# Altium project Gas_Sampler.PrjPcb (part 3 of 3)

## Sheet Gas_Sampler-9V_Boost.SchDoc: 9V Boost
size Tabloid; Organization: Sensible Robotics LLC; Address1: 120 E Church Ave Suite B; Address2: Ridgecrest CA, 93555; Revision: 0; SheetNumber: 6; SheetTotal: 12; ApprovedBy: Approved Name; Engineer: Mike Licitra; PageSetup: Record=PageOptions|CenterHorizontal=True|CenterVertical=True|PrintScale=0.98|XCorrection=1.00|YCorrection=1.00|PrintKind=0|BorderSize=5000000|LeftOffset=0|BottomOffset=0|Orientation=2|PaperLength=1000|PaperWidth=1000|Scale=100|PaperSource=15|PrintQuality=600|MediaType=1|DitherType=10|PaperKind=Tabloid|PrintScaleMode=1
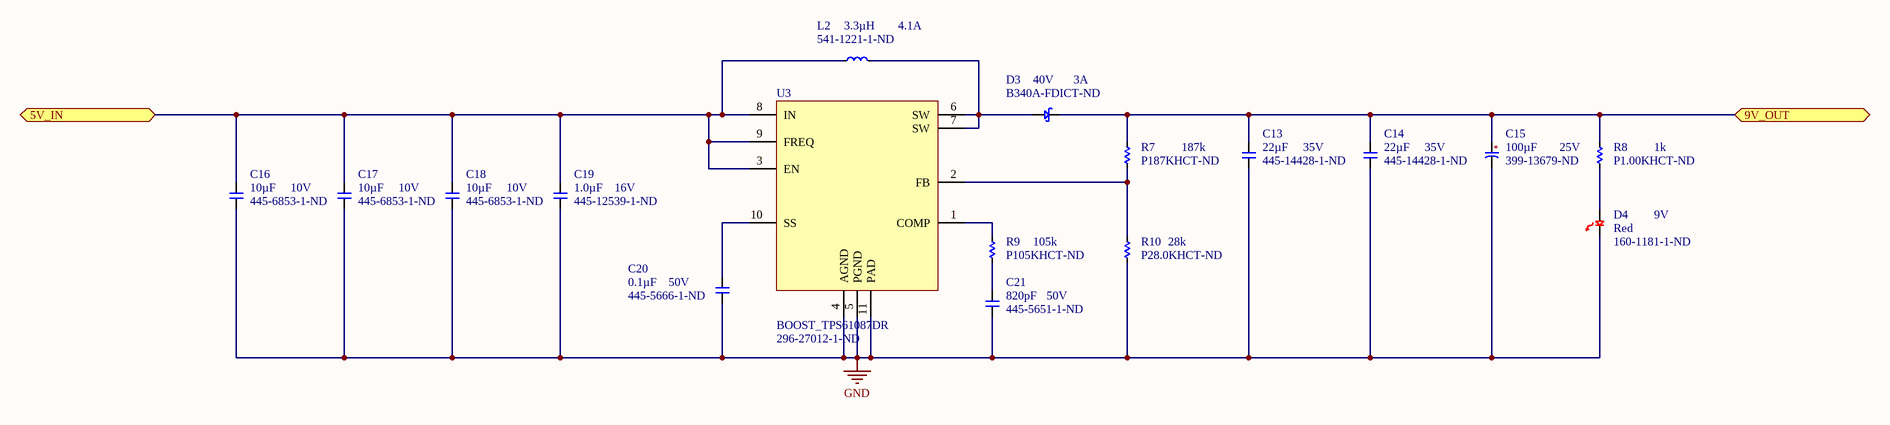
[diagram p11: Gas_Sampler-9V_Boost.SchDoc]

### Parts
C13  value 22µF  Supplier Part Number 1: 445-14428-1-ND  Voltage - Rated: 35V  [C0805]  (hidden comment: CAP_CER_0805_22UF_35V_20%_X5R)
C14  value 22µF  Supplier Part Number 1: 445-14428-1-ND  Voltage - Rated: 35V  [C0805]  (hidden comment: CAP_CER_0805_22UF_35V_20%_X5R)
C15  value 100µF  Supplier Part Number 1: 399-13679-ND  Voltage: 25V  [CAP_RADIAL_8MM_DIA_9MM_LEN_3.5MM_LEADSPACE]  (hidden comment: CAP_POLYMER_100UF_25V_20%_8X9MM_TH)
C16  value 10µF  Voltage - Rated: 10V  Supplier Part Number 1: 445-6853-1-ND  [C0603]  (hidden comment: CAP_CER_0603_10UF_10V_20%_X5R)
C17  value 10µF  Voltage - Rated: 10V  Supplier Part Number 1: 445-6853-1-ND  [C0603]  (hidden comment: CAP_CER_0603_10UF_10V_20%_X5R)
C18  value 10µF  Voltage - Rated: 10V  Supplier Part Number 1: 445-6853-1-ND  [C0603]  (hidden comment: CAP_CER_0603_10UF_10V_20%_X5R)
C19  value 1.0µF  Supplier Part Number 1: 445-12539-1-ND  Voltage - Rated: 16V  [C0603]  (hidden comment: CAP_CER_0603_1UF_16V_10%_X7R)
C20  value 0.1µF  Voltage - Rated: 50V  Supplier Part Number 1: 445-5666-1-ND  [C0603]  (hidden comment: CAP_CER_0603_0.1UF_50V_10%_X7R)
C21  value 820pF  Voltage - Rated: 50V  Supplier Part Number 1: 445-5651-1-ND  [C0603]  (hidden comment: CAP_CER_0603_820PF_50V_5%_C0G/NP0)
D3  Supplier Part Number 1: B340A-FDICT-ND  Voltage - DC Reverse (Vr) (Max): 40V  Current - Average Rectified (Io): 3A  [SMA]  (hidden comment: SCHOTTKY_40V_3A_B340A-13-F)
D4  9V  Supplier Part Number 1: 160-1181-1-ND  Color: Red  [LED_0603_RED]
L2  value 3.3µH  Current Rating: 4.1A  Supplier Part Number 1: 541-1221-1-ND  [INDUCTOR_IHLP2020_2MM_HEIGHT]  (hidden comment: IND_3.3UH_4.1A_IHLP2020BZER3R3M11)
R7  value 187k  Supplier Part Number 1: P187KHCT-ND  [R0603]  (hidden comment: RES_0603_187K_OHMS_1/10W_1%)
R8  value 1k  Supplier Part Number 1: P1.00KHCT-ND  [R0603]  (hidden comment: RES_0603_1K_OHM_1/10W_1%)
R9  value 105k  Supplier Part Number 1: P105KHCT-ND  [R0603]  (hidden comment: RES_0603_105K_OHM_1/10W_1%)
R10  value 28k  Supplier Part Number 1: P28.0KHCT-ND  [R0603]  (hidden comment: RES_0603_28K_OHM_1/10W_1%)
U3  BOOST_TPS61087DR  Supplier Part Number 1: 296-27012-1-ND  [PVSON50P300X300X70-10N]

### Ports
5V_IN, 9V_OUT

### Nets
+5: C16.1 C17.1 C18.1 C19.1 L2.1 U3.3(EN) U3.8(IN) U3.9(FREQ) ; port 5V_IN
GND: C13.2 C14.2 C15.2 C16.2 C17.2 C18.2 C19.2 C20.2 C21.2 D4.2(CATHODE) R10.1 U3.4(AGND) U3.5(PGND) U3.11(PAD)
NetC13_1: C13.1 C14.1 C15.1 D3.2 R7.2 R8.2 ; port 9V_OUT
NetC20_1: C20.1 U3.10(SS)
NetC21_1: C21.1 R9.1
NetD3_1: D3.1 L2.2 U3.6(SW) U3.7(SW)
NetD4_1: D4.1(ANODE) R8.1
NetR7_1: R7.1 R10.2 U3.2(FB)
NetR9_2: R9.2 U3.1(COMP)

### Notes on the sheet
- CONFIDENTIAL DOCUMENT
- DUPLICATION PROHIBITED
- ENGINEER
- PCB FAB #
- SCH #
- REV
- Sensible
- Robotics
- THIS DOCUMENT CONTAINS INFORMATION AND OR DATA, WHICH IS PROPRIETARY AND CONFIDENTIAL TO SENSIBLE ROBOTICS LLC.  THIS INFORMATION AND OR DATA, IS TO BE USED ONLY FOR THE BENEFIT OF THE SUPPLIER, AND IS NOT TO BE USED FOR THE BENEFIT OF OTHER PARTIES WITHOUT WRITTEN CONSENT.
- DATE
- PCB ASSY #
- SIZE
- Tabloid
- SHEET
- OF
- FILE
- (in symbol CAP_POLYMER_100UF_25V_20%_8X9MM_TH) +

### Library data of the parts
C13 C14 = CAP_CER_0805_22UF_35V_20%_X5R: CAP CER 22UF 35V 20% X5R 0805; Manufacturer: TDK Corporation; Manufacturer Part Number: C2012X5R1V226M125AC; Part Number: 150-00071-00; Supplier 1: Digi-Key; RoHS: RoHS Compliant; Category: Capacitors; Stock 1: 6377; Pricing 1: 1=1.18, 10=0.987, 100=0.63, 250=0.525, 500=0.4725, 1000=0.4305 (USD); Packaging: Cut Tape (CT); Tolerance: ±20%; Temperature Coefficient: X5R; Mounting Type: Surface Mount, MLCC; Operating Temperature: -55°C ~ 85°C; Applications: General Purpose; Package / Case: 0805 (2012 Metric); Size / Dimension: 0.079" L x 0.049" W (2.00mm x 1.25mm); Thickness (Max): 0.057" (1.45mm); ComponentLink1URL: http://product.tdk.com/capacitor/mlcc/en/documents/mlcc_commercial_general_en.pdf; ComponentLink1Description: http://product.tdk.com/capacitor/mlcc/en/documents/mlcc_commercial_general_en.pdf
C15 = CAP_POLYMER_100UF_25V_20%_8X9MM_TH: CAP ALUM POLY 100UF 20% 25V T/H; Manufacturer: KEMET; Manufacturer Part Number: A750KK107M1EAAE040; ComponentLink1Description: Datasheet; ComponentLink1URL: https://api.kemet.com/component-edge/download/datasheet/A750KK107M1EAAE040.pdf; Supplier 1: Digikey; Tolerance: ±20%; Operating Temperature: -55°C ~ 105°C; Size / Dimension: 0.315" Dia (8.00mm); Height - Seated (Max): 0.354" (9.00mm); Mounting Type: Through Hole
C16-C18 = CAP_CER_0603_10UF_10V_20%_X5R: CAP CER 10UF 10V X5R 0603; Manufacturer: TDK Corporation; Manufacturer Part Number: C1608X5R1A106M080AC; Tolerance: ±20%; Supplier 1: Digi-Key; RoHS: RoHS Compliant; Packaging: Cut Tape (CT); Part Status: Active; Temperature Coefficient: X5R; Operating Temperature: -55°C ~ 85°C; Features: Low ESL; Applications: General Purpose; Mounting Type: Surface Mount, MLCC; Package / Case: 0603 (1608 Metric); Size / Dimension: 0.063" L x 0.032" W (1.60mm x 0.80mm); Thickness (Max): 0.035" (0.90mm); ComponentLink1URL: https://product.tdk.com/info/en/catalog/datasheets/mlcc_commercial_general_en.pdf; ComponentLink1Description: https://product.tdk.com/info/en/catalog/datasheets/mlcc_commercial_general_en.pdf
C19 = CAP_CER_0603_1UF_16V_10%_X7R: CAP CER 1UF 16V 10% X7R 0603; Manufacturer: TDK Corporation; Manufacturer Part Number: CGA3E1X7R1C105K080AC; Supplier 1: Digi-Key; RoHS: RoHS Compliant; Packaging: Cut Tape (CT); Tolerance: ±10%; Temperature Coefficient: X7R; Mounting Type: Surface Mount, MLCC; Operating Temperature: -55°C ~ 125°C; Applications: Automotive; Ratings: AEC-Q200; Package / Case: 0603 (1608 Metric); Size / Dimension: 0.063" L x 0.031" W (1.60mm x 0.80mm); Thickness (Max): 0.035" (0.90mm); ComponentLink1URL: http://product.tdk.com/capacitor/mlcc/en/documents/mlcc_automotive_general_en.pdf; ComponentLink1Description: http://product.tdk.com/capacitor/mlcc/en/documents/mlcc_automotive_general_en.pdf
C20 = CAP_CER_0603_0.1UF_50V_10%_X7R: CAP CER 0.1UF 50V 10% X7R 0603; Manufacturer: TDK Corporation; Manufacturer Part Number: CGA3E2X7R1H104K080AA; Supplier 1: Digi-Key; RoHS: RoHS Compliant; Packaging: Cut Tape (CT); Tolerance: ±10%; Temperature Coefficient: X7R; Mounting Type: Surface Mount, MLCC; Operating Temperature: -55°C ~ 125°C; Applications: Automotive; Ratings: AEC-Q200; Package / Case: 0603 (1608 Metric); Size / Dimension: 0.063" L x 0.031" W (1.60mm x 0.80mm); Thickness (Max): 0.035" (0.90mm); ComponentLink1URL: http://product.tdk.com/capacitor/mlcc/en/documents/mlcc_automotive_general_en.pdf; ComponentLink1Description: http://product.tdk.com/capacitor/mlcc/en/documents/mlcc_automotive_general_en.pdf
C21 = CAP_CER_0603_820PF_50V_5%_C0G/NP0: CAP CER 820PF 50V C0G 0603; Manufacturer: TDK Corporation; Manufacturer Part Number: CGA3E2C0G1H821J080AA; Tolerance: ±5%; Temperature Coefficient: C0G, NP0; Supplier 1: Digi-Key; RoHS: RoHS Compliant; Packaging: Cut Tape (CT); Part Status: Active; Operating Temperature: -55°C ~ 125°C; Ratings: AEC-Q200; Applications: Automotive; Mounting Type: Surface Mount, MLCC; Package / Case: 0603 (1608 Metric); Size / Dimension: 0.063" L x 0.032" W (1.60mm x 0.80mm); Thickness (Max): 0.035" (0.90mm); ComponentLink1URL: https://product.tdk.com/info/en/catalog/datasheets/mlcc_automotive_general_en.pdf; ComponentLink1Description: https://product.tdk.com/info/en/catalog/datasheets/mlcc_automotive_general_en.pdf
D3 = SCHOTTKY_40V_3A_B340A-13-F: DIODE SCHOTTKY 3A 40V SMA; Manufacturer: Diodes Inc; Part Number: 480-00147-00; Voltage - Forward (Vf) (Max) @ If: 500mV @ 3A; Speed: Fast Recovery =< 500ns, > 200mA (Io); Current - Reverse Leakage @ Vr: 500µA @ 40V; Capacitance @ Vr, F: 200pF @ 4V, 1MHz; Supplier 1: Digi-Key; Manufacturer Part Number: B340A-13-F; RoHS: RoHS Compliant; Category: Discrete Semiconductor Products; Stock 1: 414723; Pricing 1: 1=0.47, 10=0.368, 25=0.31, 100=0.2527, 250=0.20932, 500=0.1729, 1000=0.1295, 2500=0.119 (USD); Diode Type: Schottky; Reverse Recovery Time (trr): -; Mounting Type: Surface Mount; Package / Case: DO-214AC, SMA; Supplier Device Package: SMA; Packaging: Cut Tape (CT); ComponentLink1URL: http://www.diodes.com/datasheets/ds30891.pdf; ComponentLink1Description: Datasheet
D4 = LED_0603_RED_LR_LTST-C190CKT: LED RED CLEAR 0603 SMD; Manufacturer: Lite-On Inc; Millicandela Rating: 10mcd; Wavelength - Dominant: 638nm; Wavelength - Peak: 660nm; Viewing Angle: 130°; Lens Style/Size: Rectangle with Flat Top, 1.1mm x 0.8mm; Voltage - Forward (Vf) Typ: 1.8V; Current - Test: 10mA; Supplier 1: Digi-Key; Manufacturer Part Number: LTST-C190CKT; Lens Type: Clear; Package / Case: 0603 (1608 Metric); Size / Dimension: 1.60mm L x 0.80mm W; Height: 0.80mm; Mounting Type: Surface Mount; Packaging: Cut Tape (CT); ComponentLink1URL: http://media.digikey.com/pdf/Data%20Sheets/Lite-On%20PDFs/LTST-C190CKT.pdf; ComponentLink1Description: Datasheet
L2 = IND_3.3UH_4.1A_IHLP2020BZER3R3M11: FIXED IND 3.3UH 4.1A 57.8 MOHM; Manufacturer: Vishay Dale; Type: Molded; Tolerance: ±20%; Shielding: Shielded; DC Resistance (DCR): 57.8 mOhm Max; Supplier 1: Digi-Key; Manufacturer Part Number: IHLP2020BZER3R3M11; Category: Inductors, Coils, Chokes; Packaging: Cut Tape (CT); Part Status: Active; Operating Temperature: -55°C ~ 125°C; Mounting Type: Surface Mount; Package / Case: Nonstandard; Size / Dimension: 0.216" L x 0.204" W (5.49mm x 5.18mm); Height - Seated (Max): 0.079" (2.00mm); ComponentLink1URL: http://www.vishay.com/docs/34261/ihlp2020bz11.pdf; ComponentLink1Description: http://www.vishay.com/docs/34261/ihlp2020bz11.pdf
R7 = RES_0603_187K_OHMS_1/10W_1%: RES 187K OHM 1% 1/10W 0603; Manufacturer: Panasonic Electronic Components; Manufacturer Part Number: ERJ-3EKF1873V; Power (Watts): 0.1W, 1/10W; Temperature Coefficient: ±100ppm/°C; Supplier 1: Digi-Key; RoHS: RoHS Compliant; Category: Resistors; Stock 1: 170408; Pricing 1: 1=0.1, 10=0.08, 100=0.0334, 1000=0.0156, 2500=0.01369 (USD); Packaging: Cut Tape (CT); Part Status: Active; Tolerance: ±1%; Composition: Thick Film; Features: Automotive AEC-Q200; Operating Temperature: -55°C ~ 155°C; Package / Case: 0603 (1608 Metric); Supplier Device Package: 0603; Size / Dimension: 0.063" L x 0.032" W (1.60mm x 0.80mm); Height - Seated (Max): 0.022" (0.55mm); ComponentLink1URL: https://industrial.panasonic.com/cdbs/www-data/pdf/RDA0000/AOA0000C304.pdf; ComponentLink1Description: https://industrial.panasonic.com/cdbs/www-data/pdf/RDA0000/AOA0000C304.pdf
R8 = RES_0603_1K_OHM_1/10W_1%: RES 1K OHM 1/10W 1% 0603 SMD; Manufacturer: Panasonic Electronic Components; Manufacturer Part Number: ERJ-3EKF1001V; Power (Watts): 0.1W, 1/10W; Temperature Coefficient: ±100ppm/°C; Supplier 1: Digi-Key; RoHS: RoHS Compliant; Packaging: Cut Tape (CT); Composition: Thick Film; Features: -; Tolerance: ±1%; Package / Case: 0603 (1608 Metric); Supplier Device Package: 0603; Size / Dimension: 0.063" L x 0.031" W (1.60mm x 0.80mm); Height: 0.022" (0.55mm); Number of Terminations: 2; ComponentLink1URL: http://industrial.panasonic.com/www-cgi/jvcr13pz.cgi?E+PZ+3+AOA0002+ERJ3EKF1001V+7+WW; ComponentLink1Description: http://industrial.panasonic.com/www-cgi/jvcr13pz.cgi?E+PZ+3+AOA0002+ERJ3EKF1001V+7+WW
R9 = RES_0603_105K_OHM_1/10W_1%: RES 105K OHM 1% 1/10W 0603; Manufacturer: Panasonic Electronic Components; Manufacturer Part Number: ERJ-3EKF1053V; Power (Watts): 0.1W, 1/10W; Temperature Coefficient: ±100ppm/°C; Supplier 1: Digi-Key; RoHS: RoHS Compliant; Category: Resistors; Stock 1: 178265; Pricing 1: 1=0.1, 10=0.021, 100=0.0087, 1000=0.00389, 2500=0.00338 (USD); Packaging: Cut Tape (CT); Part Status: Active; Tolerance: ±1%; Composition: Thick Film; Features: Automotive AEC-Q200; Operating Temperature: -55°C ~ 155°C; Package / Case: 0603 (1608 Metric); Supplier Device Package: 0603; Size / Dimension: 0.063" L x 0.031" W (1.60mm x 0.80mm); Height - Seated (Max): 0.022" (0.55mm); Failure Rate: -; ComponentLink1URL: http://media.digikey.com/pdf/Data%20Sheets/Panasonic%20Electronic%20Components/ERJ%20Series_Precision.pdf; ComponentLink1Description: http://media.digikey.com/pdf/Data%20Sheets/Panasonic%20Electronic%20Components/ERJ%20Series_Precision.pdf
R10 = RES_0603_28K_OHM_1/10W_1%: RES 28K OHM 1/10W 1% 0603 SMD; Manufacturer: Panasonic Electronic Components; Manufacturer Part Number: ERJ-3EKF2802V; Part Number: 470-00108-00; Power (Watts): 0.1W, 1/10W; Temperature Coefficient: ±100ppm/°C; Supplier 1: Digi-Key; RoHS: RoHS Compliant; Category: Resistors; Stock 1: 91509; Pricing 1: 1=0.1, 50=0.0138, 100=0.0105, 250=0.0078, 500=0.00576, 1000=0.00384 (USD); Packaging: Cut Tape (CT); Composition: Thick Film; Features: -; Tolerance: ±1%; Package / Case: 0603 (1608 Metric); Supplier Device Package: 0603; Size / Dimension: 0.063" L x 0.031" W (1.60mm x 0.80mm); Height: 0.022" (0.55mm); Number of Terminations: 2; ComponentLink1URL: http://industrial.panasonic.com/www-cgi/jvcr13pz.cgi?E+PZ+3+AOA0002+ERJ3EKF2802V+7+WW; ComponentLink1Description: http://industrial.panasonic.com/www-cgi/jvcr13pz.cgi?E+PZ+3+AOA0002+ERJ3EKF2802V+7+WW
U3 = BOOST_TPS61087DR: IC REG BOOST ADJ 3.2A 10SON; Manufacturer: Texas Instruments; Manufacturer Part Number: TPS61087DRCR; Function: Step-Up; Output Configuration: Positive; Output Type: Adjustable; Number of Outputs: 1; Voltage - Input (Min): 2.5V; Voltage - Input (Max): 6V; Voltage - Output (Min/Fixed): 3V; Voltage - Output (Max): 18.5V; Current - Output: 3.2A (Switch); Frequency - Switching: 650kHz, 1.2MHz; Synchronous Rectifier: No; Supplier 1: Digi-Key; RoHS: RoHS Compliant; Category: Integrated Circuits (ICs); Packaging: Cut Tape (CT); Topology: Boost; Operating Temperature: -40°C ~ 125°C (TA); Mounting Type: Surface Mount; Package / Case: 10-VFDFN Exposed Pad; Supplier Device Package: 10-VSON (3x3); ComponentLink1URL: https://www.ti.com/lit/ds/symlink/tps61087.pdf; ComponentLink1Description: https://www.ti.com/lit/ds/symlink/tps61087.pdf

## Nets that join several sheets
+3.3: Gas_Sampler-Top (J2.1 R27.2 R28.2), Gas_Sampler-BME_280 (8 pins), Gas_Sampler-GPS (U7.9), Gas_Sampler-Flow_Sensor (C27.1 U6.5), Gas_Sampler-Vin (C37.1 U10.5), Gas_Sampler-3.3V_LDO (5 pins), Gas_Sampler-Sensors (C32.1 R23.2 U9.5)
+5: Gas_Sampler-RFD_Radio (C31.1 CN5.4), Gas_Sampler-Motor (FB2.1), Gas_Sampler-Flow_Sensor (FB1.1), Gas_Sampler-5V_Buck (5 pins), Gas_Sampler-3.3V_LDO (C3.1 C39.1 U1.1), Gas_Sampler-Sensors (R24.2), Gas_Sampler-9V_Boost (8 pins)
+VIN: Gas_Sampler-Vin (5 pins), Gas_Sampler-5V_Buck (C6.1 C7.1 C8.1 U2.1)
GND: Gas_Sampler-Top (8 pins), Gas_Sampler-RFD_Radio (8 pins), Gas_Sampler-BME_280 (7 pins), Gas_Sampler-GPS (D5.2 U7.3), Gas_Sampler-NOAA_Conn (CN4.1 CN4.4), Gas_Sampler-Motor (10 pins), Gas_Sampler-Flow_Sensor (8 pins), Gas_Sampler-Vin (8 pins), Gas_Sampler-5V_Buck (14 pins), Gas_Sampler-3.3V_LDO (8 pins), Gas_Sampler-Sensors (11 pins), Gas_Sampler-9V_Boost (14 pins)
BATT_SENSE: Gas_Sampler-Top (J1.5), Gas_Sampler-Vin (TP15.1 U10.1 U10.4)
FLOW_SENSE: Gas_Sampler-Top (J1.2), Gas_Sampler-Flow_Sensor (TP1.1 U6.1 U6.4)
GPS_PPS: Gas_Sampler-Top (J2.5), Gas_Sampler-GPS (R16.2 TP4.1 U7.1)
GPS_RX: Gas_Sampler-Top (J2.6), Gas_Sampler-GPS (R14.1)
GPS_TX: Gas_Sampler-Top (J2.7), Gas_Sampler-GPS (R15.1)
MOTOR_PWM: Gas_Sampler-Top (J2.10), Gas_Sampler-Motor (R17.2 R18.2 TP5.1 U8.1)
NetC13_1: Gas_Sampler-Sensors (CN6.1), Gas_Sampler-9V_Boost (6 pins)
NOAA_RX: Gas_Sampler-Top (J2.9), Gas_Sampler-NOAA_Conn (R19.1 TP6.1)
NOAA_TX: Gas_Sampler-Top (J2.15), Gas_Sampler-NOAA_Conn (R20.1 TP7.1)
RFD_RX: Gas_Sampler-Top (J2.12), Gas_Sampler-RFD_Radio (R21.1 TP8.1)
RFD_TX: Gas_Sampler-Top (J2.13), Gas_Sampler-RFD_Radio (R22.1 TP9.1)
SCL: Gas_Sampler-Top (J2.14 R28.1 TP12.1), Gas_Sampler-BME_280 (U4.4 U5.6), Gas_Sampler-Motor (CN2.4), Gas_Sampler-Sensors (CN7.4)
SDA: Gas_Sampler-Top (J2.11 R27.1 TP11.1), Gas_Sampler-BME_280 (U4.3 U5.1), Gas_Sampler-Motor (CN2.3), Gas_Sampler-Sensors (CN7.3)
SO2_SENSE: Gas_Sampler-Top (J1.3), Gas_Sampler-Sensors (TP10.1 U9.1 U9.4)